# Altium schematic sheet v1.0.SchDoc
size 101 x 30 mm
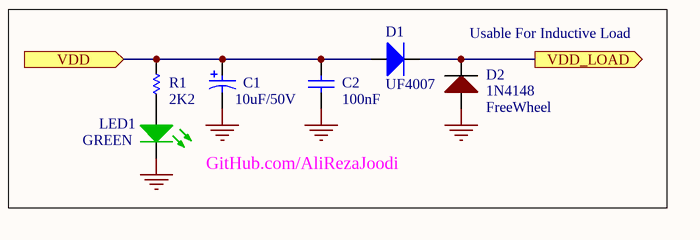
[diagram p0: v1.0.SchDoc]

## Parts
C1  10uF/50V  [C_THD_EL_(P2.54-D6-H11)]
C2  100nF  [C_THD_CER_(P2.54-D3.5-T1.5)]
D1  UF4007  [D_THD_AXIAL0.4_DO-41]
D2  1N4148  [D_THD_AXIAL0.3_DO-35]
LED1  GREEN  [LED_THD_5MM_GREEN]
R1  2K2  [R_THD_AXIAL0.4(1/4W)]

## Ports
VDD (in), VDD_LOAD (out)

## Nets
GND: C1.2 C2.2 D2.1(A) LED1.2(K)
VDD: C1.1 C2.1 D1.1(A) R1.2 ; port VDD
VDD_LOAD: D1.2(K) D2.2(K) ; port VDD_LOAD
NetLED1_1: LED1.1(A) R1.1

## Notes on the sheet
- (near D2) Usable For Inductive Load
- (near D2) FreeWheel
- GitHub.com/AliRezaJoodi

## Library data of the parts
C1 = Capacitor_Electrolytic: Capacitor, Electrolytic; Revision: July-2002: Re-released for DXP Platform.
C2 = Capacitor_Ceramic: Capacitor, Ceramic Multilayer; Revision: July-2002: Re-released for DXP Platform.
D1 = Diode: Diode,; Revision: July-2002: Re-released for DXP Platform.
D2 = Diode_2Form: Diode,; Revision: July-2002: Re-released for DXP Platform.
LED1 = LED_GREEN: LED, Green; Manufacturer: Generic Components; Class I: Optoelectronic; Published: 8-Jun-2000; Revision: July-2002: Re-released for DXP Platform.; Publisher: Altium Limited; Class II: LED
R1 = Resistor: Revision: July-2002: Re-released for DXP Platform.